# EAGLE schematic MiniWhipNext (EAGLE 8.6.0)
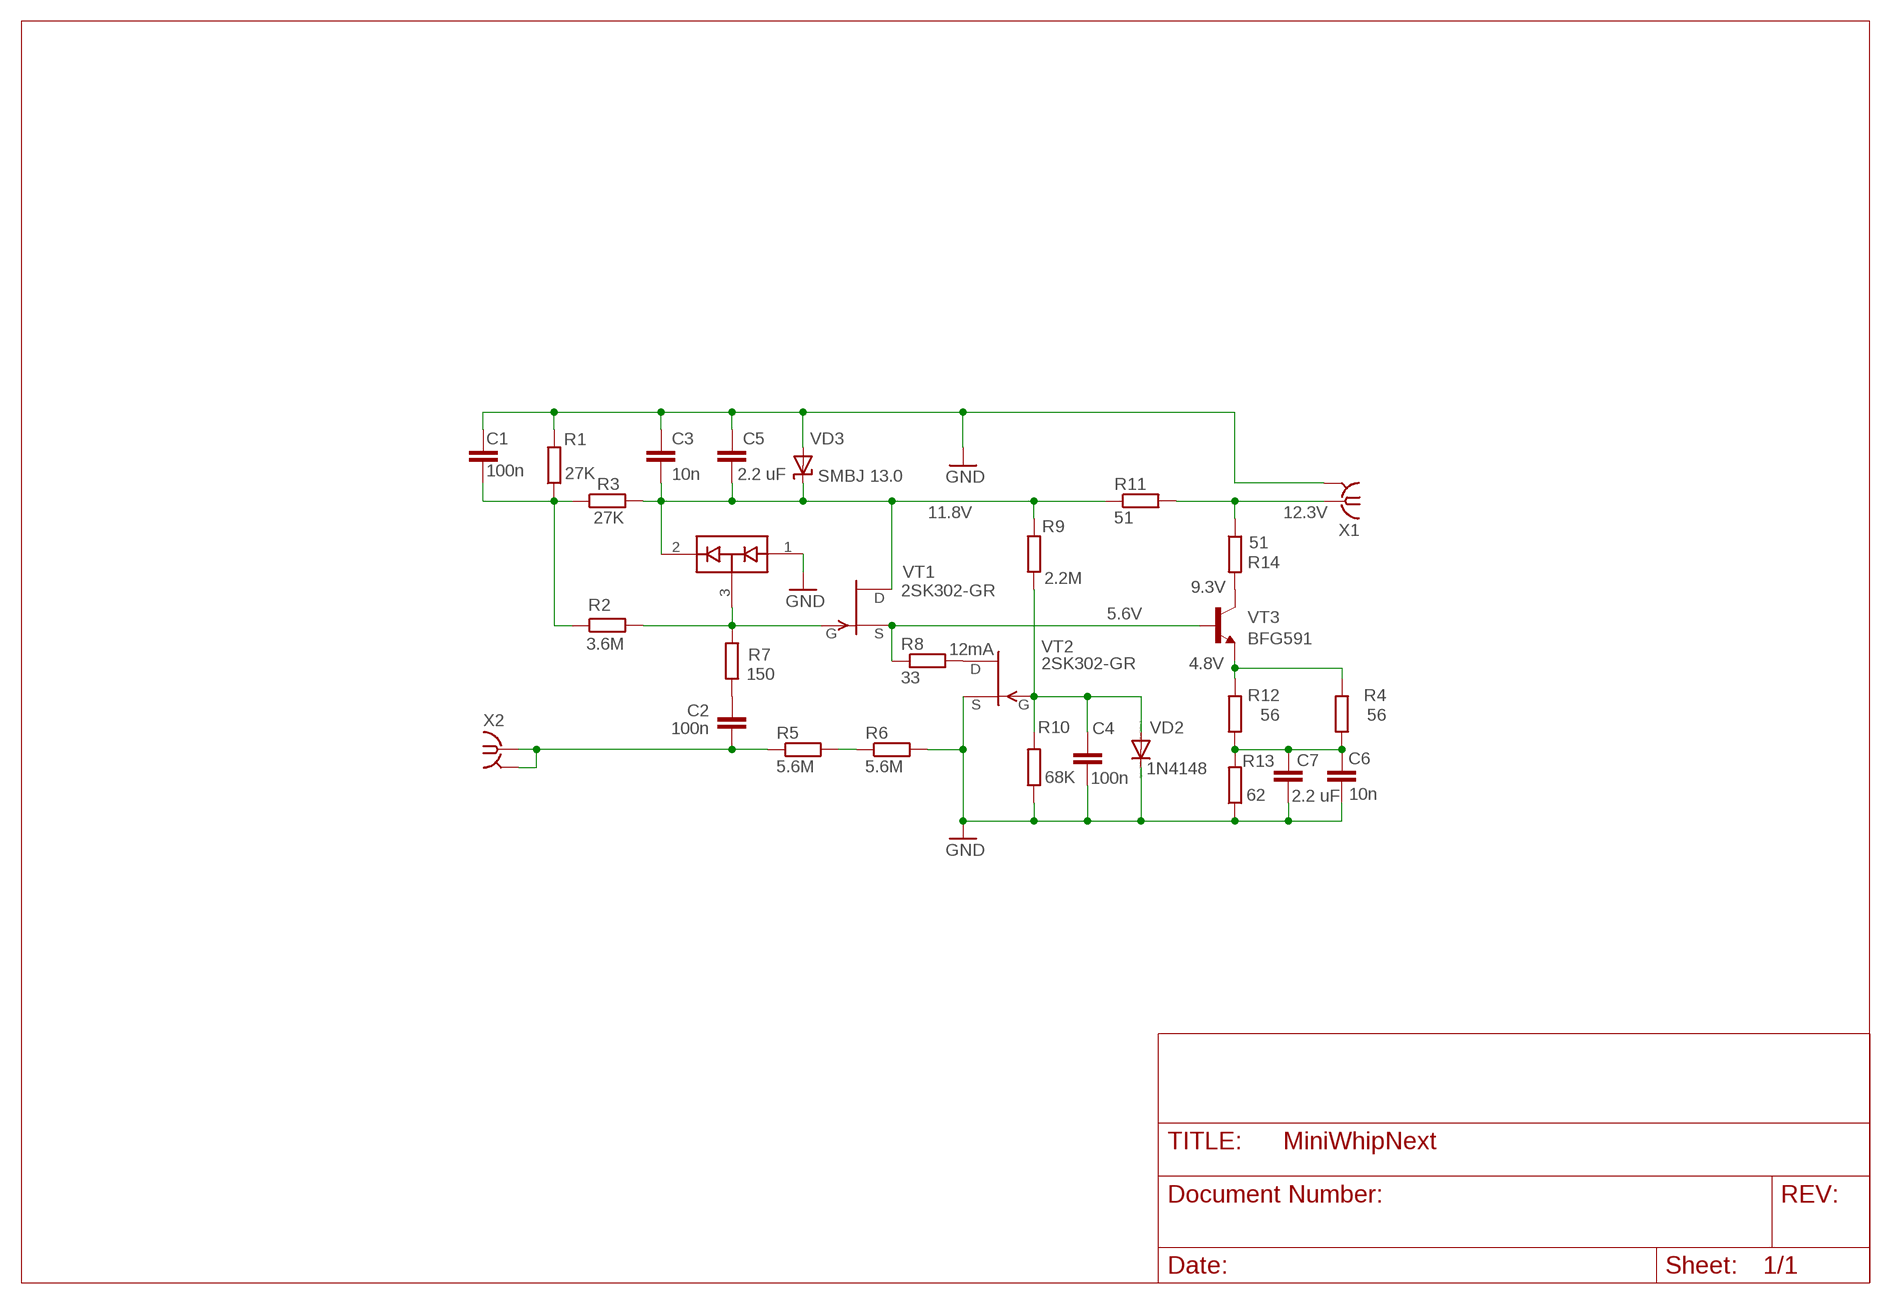
[diagram p0: schematic, sheet 1]

## Parts
C1  100n  C-EUC0603  [C0603]
C2  100n  C-EUC0603  [C0603]
C3  10n  C-EUC0603  [C0603]
C4  100n  C-EUC0603  [C0603]
C5  2.2 uF  C-EUC0603  [C0603]
C6  10n  C-EUC0603  [C0603]
C7  2.2 uF  C-EUC0603  [C0603]
R1  27K  R-EU_R0603  [R0603]
R2  3.6M  R-EU_R0805  [R0805]
R3  27K  R-EU_R0603  [R0603]
R4  56  R-EU_R0603  [R0603]
R5  5.6M  R-EU_R0805  [R0805]
R6  5.6M  R-EU_R0805  [R0805]
R7  150  R-EU_R0805  [R0805]
R8  33  R-EU_R0805  [R0805]
R9  2.2M  R-EU_R0603  [R0603]
R10  68K  R-EU_R0603  [R0603]
R11  51  R-EU_R0603  [R0603]
R12  56  R-EU_R0603  [R0603]
R13  62  R-EU_R0603  [R0603]
R14  51  R-EU_R0603  [R0603]
VD1  BAV99  [SOT23]
VD2  1N4148  DIODE-SOD80C  [SOD80C]
VD3  SMBJ 13.0  SUPPRESSOR-SMBJ  [SMBJ]
VT1  2SK302SOT23  [SOT23]
VT2  2SK302SOT23  [SOT23]
VT3  BFG591  [SOT223]
X1  SMA-142-0701-801/806  [J502-ND-142-0701-801/806]
X2  SMA-142-0701-801/806  [J502-ND-142-0701-801/806]

## Nets
+12V: C3.2 C5.2 R3.2 R9.2 R11.1 VD1.2(C2) VD3.C VT1.1(D)
GND: C1.1 C3.1 C4.2 C5.1 C6.2 C7.2 R1.2 R6.2 R10.1 R13.1 VD1.1(A1) VD2.C VD3.A VT2.3(S) X1.G@1 X1.G@2 X1.G@3 X1.G@4
IN: C2.2 R5.1 X2.1 X2.G@1 X2.G@2 X2.G@3 X2.G@4
N$1: C1.2 R1.1 R2.1 R3.1
N$4: R14.2 VT3.4(C)
N$5: R2.2 R7.1 VD1.3(COM) VT1.2(G)
N$6: C6.1 C7.1 R4.1 R12.1 R13.2
N$7: R4.2 R12.2 VT3.1(E) VT3.3(E)
N$9: R8.2 VT2.1(D)
N$10: C4.1 R9.1 R10.2 VD2.A VT2.2(G)
N$11: C2.1 R7.2
N$12: R5.2 R6.1
OUT: R11.2 R14.1 X1.1
PREAMP: R8.1 VT1.3(S) VT3.2(B)

## Notes on the sheet
- 11.8V | 12.3V
- 2SK302-GR | 9.3V
- 5.6V
- 12mA
- 2SK302-GR | 4.8V

## Library data of the parts
C1-C7 = resistor:C-EU: CAPACITOR, European symbol
R1-R14 = resistor:R-EU_: RESISTOR, European symbol
VD1 = SparkFun-DiscreteSemi:BAV99: Two small signal silicon diodes connected anode to cathode. Connections to all three nodes available. DIO-10647; PROD_ID: DIO-10647
VD2 = diode:DIODE-: DIODE
VD3 = diode:SUPPRESSOR-: Suppressor diode
VT1 VT2 = transistor-fet-my:2SK302: Silicon N-Channel MOS FET Source: HITACHI .. 2SK439.pdf
VT3 = transistor-npn-my:BFG591: NPN Transistor
X1 X2 = con-coax:SMA-: SMA 50 Ohm End Launch Jack Receptacle - Round Contact Johnson Components Source: www.johnsoncomponents.com .. J502-ND.pdf; MF: JOHNSON COMPONENTS; MPN: 142-0701-801; OC_FARNELL: 1608592; OC_NEWARK: 90F2624

## Net classes
0 default: clearance 0.205 mm